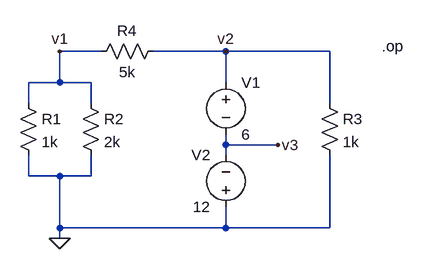
[diagram p0: schematic example2.asc]
example2.asc, the LTspice schematic file:
Version 4
SHEET 1 880 680
WIRE 128 16 64 16
WIRE 320 16 208 16
WIRE 480 16 320 16
WIRE 64 64 64 16
WIRE 64 64 16 64
WIRE 112 64 64 64
WIRE 320 64 320 16
WIRE 16 96 16 64
WIRE 112 96 112 64
WIRE 480 96 480 16
WIRE 320 160 320 144
WIRE 400 160 320 160
WIRE 320 176 320 160
WIRE 16 208 16 176
WIRE 64 208 16 208
WIRE 112 208 112 176
WIRE 112 208 64 208
WIRE 64 288 64 208
WIRE 320 288 320 256
WIRE 320 288 64 288
WIRE 480 288 480 176
WIRE 480 288 320 288
WIRE 64 304 64 288
FLAG 64 304 0
FLAG 64 16 v1
FLAG 320 16 v2
FLAG 400 160 v3
SYMBOL res 0 80 R0
SYMATTR InstName R1
SYMATTR Value 1k
SYMBOL res 96 80 R0
SYMATTR InstName R2
SYMATTR Value 2k
SYMBOL res 464 80 R0
SYMATTR InstName R3
SYMATTR Value 1k
SYMBOL res 224 0 R90
WINDOW 0 0 56 VBottom 2
WINDOW 3 32 56 VTop 2
SYMATTR InstName R4
SYMATTR Value 5k
SYMBOL voltage 320 48 R0
SYMATTR InstName V1
SYMATTR Value 6
SYMBOL voltage 320 272 R180
WINDOW 0 24 96 Left 2
WINDOW 3 24 16 Left 2
WINDOW 123 0 0 Left 0
WINDOW 39 0 0 Left 0
SYMATTR InstName V2
SYMATTR Value 12
TEXT 560 8 Left 2 !.op

The netlist it stands for:
* example2.asc
R1 v1 0 1k
R2 v1 0 2k
R3 v2 0 1k
R4 v2 v1 5k
V1 v2 v3 6
V2 0 v3 12
.op
.backanno
.end